# Altium project MLB_REV1.PrjPcb (part 1 of 3)
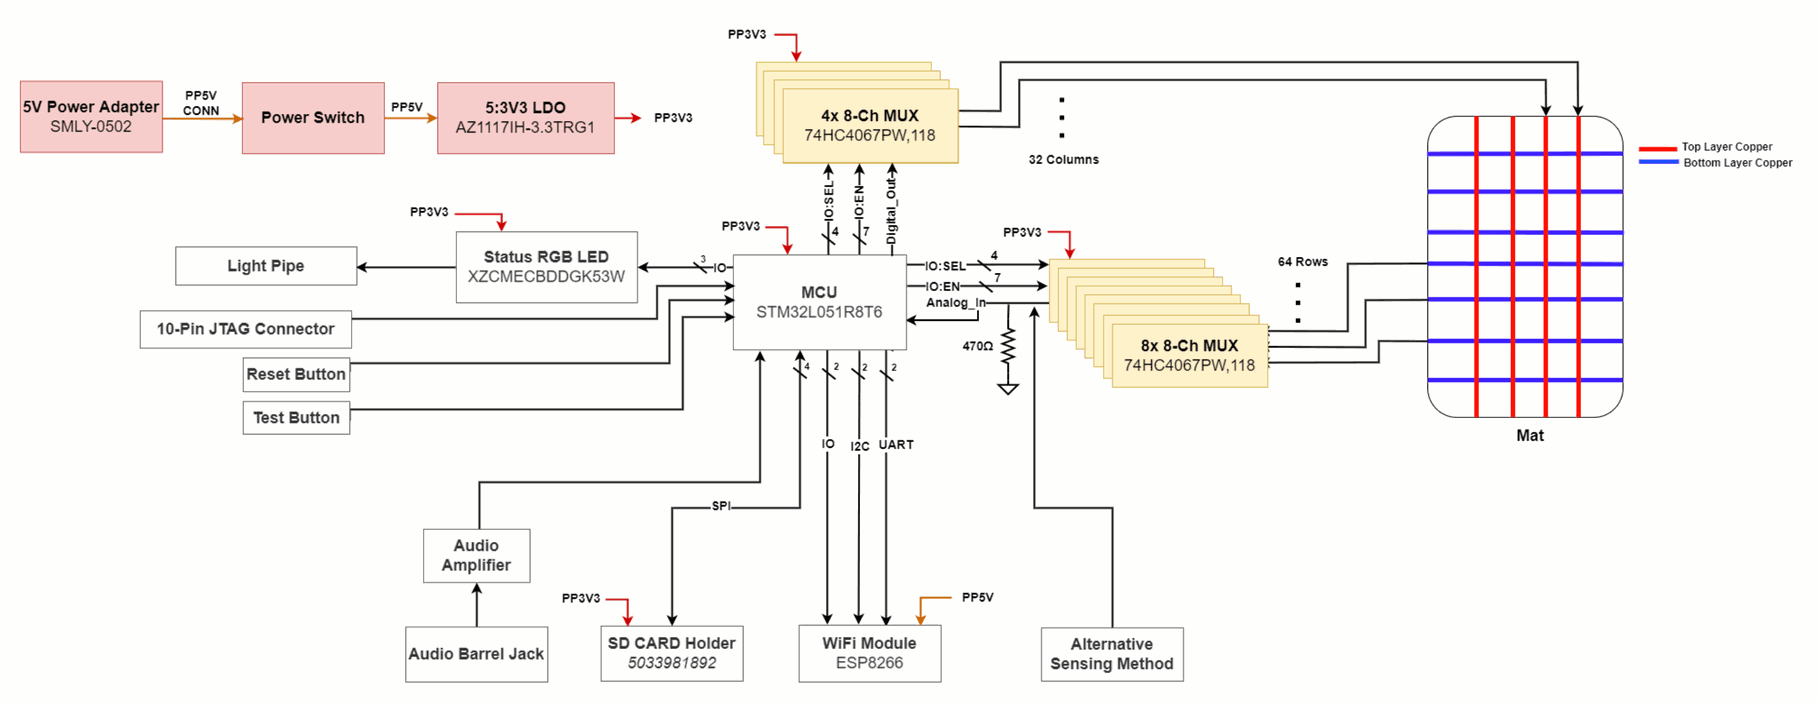
[diagram p0: BLOCK_DIAGRAM.SchDoc]
8 sheets, 307 parts. Net scope: flat (ports and power ports of the same name join across sheets).
Board file: MLB_REV1.PcbDoc
Sheets:
  BLOCK_DIAGRAM.SchDoc
  POWER_MCU.SchDoc
  SD_CARD_WiFi.SchDoc
  POWER_MUXES.SchDoc
  SENSE_MUXES.SchDoc
  VELOSTAT_SENSING.SchDoc
  MAT_CABLING_CONNECTOR.SchDoc
  MICROPHONE.SchDoc

## Sheet BLOCK_DIAGRAM.SchDoc: =DocumentName
size B; SheetNumber: 1; SheetTotal: 8

### Notes on the sheet
- Title
- Size:
- Date:
- B
- Number:
- Time:
- Revision:
- Sheet
- of
- File:

## Sheet POWER_MCU.SchDoc: =DocumentName
size B; SheetNumber: 2; SheetTotal: 8
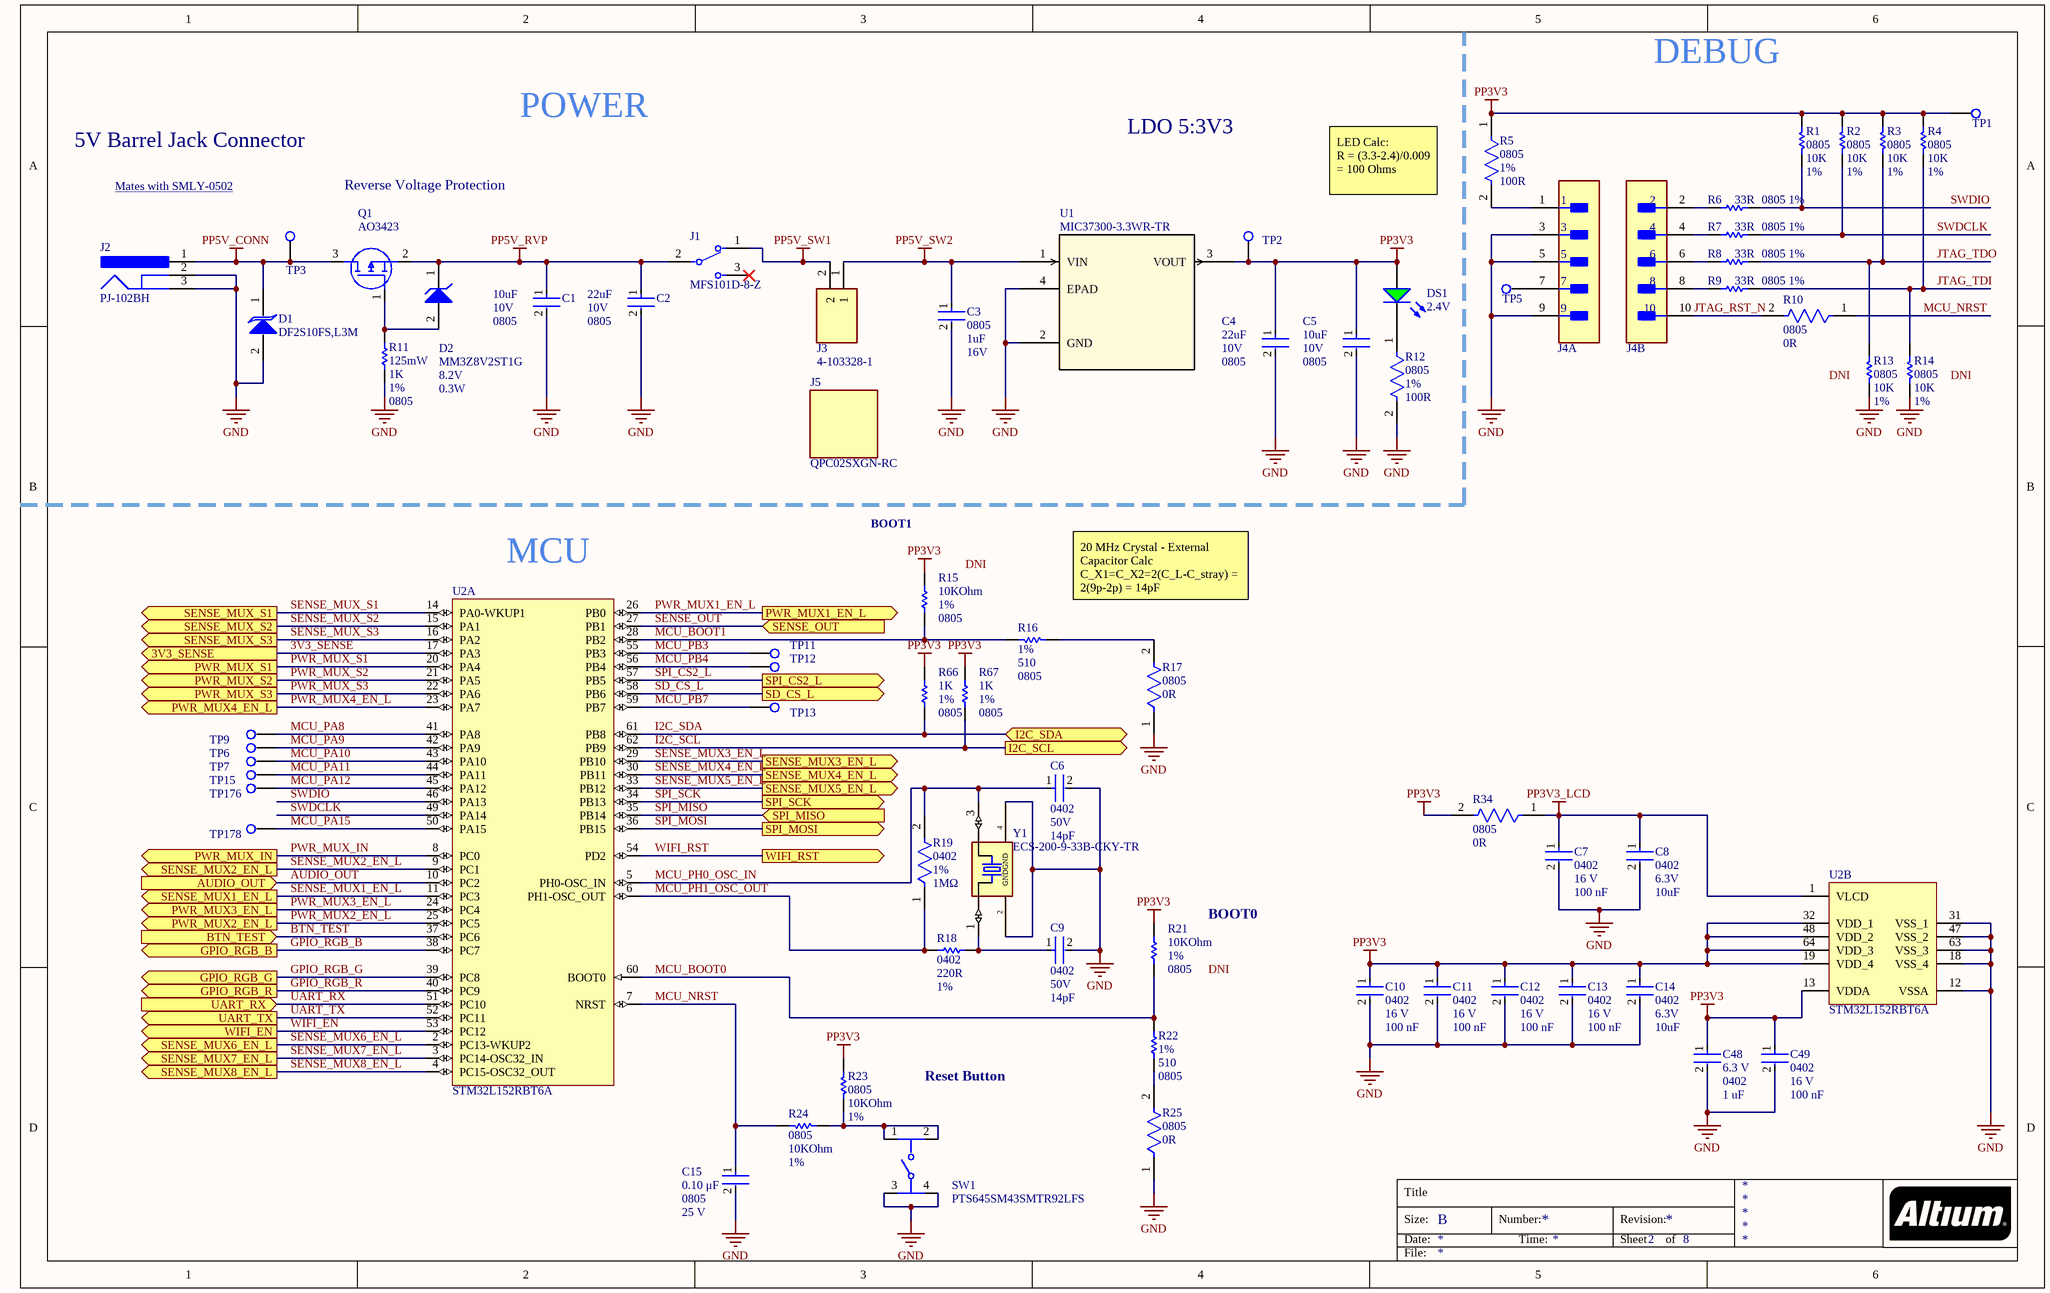
[diagram p1: POWER_MCU.SchDoc]

### Parts
(Parts that share a designator on the sheet are numbered #1, #2 ... from top to bottom, then left to right.)
C1  Case/Package: 0805  Voltage Rating (DC): 10V  Capacitance: 10uF  [FP-GRM21B-0_15-IPC_A]  (hidden comment: GRM21BR71A106KA73K)
C2  Capacitance: 22uF  Voltage Rating: 10V  Case/Package: 0805  [FP-GRM21B-0_15-IPC_A]  (hidden comment: GRM21BR61A226ME51L)
C3  Case/Package: 0805  Capacitance: 1uF  Voltage: 16V  [FP-CL21-IPC_A]  (hidden comment: CL21B105KOFNNNE)
C4  Capacitance: 22uF  Voltage Rating: 10V  Case/Package: 0805  [FP-GRM21B-0_15-IPC_A]  (hidden comment: GRM21BR61A226ME51L)
C5  Case/Package: 0805  Voltage Rating (DC): 10V  Capacitance: 10uF  [FP-GRM21B-0_15-IPC_A]  (hidden comment: GRM21BR71A106KA73K)
C6  Package Reference: 0402  Voltage Rating (DC): 50V  Capacitance: 14pF  [FP-CC0402-IPC_B]  (hidden comment: GJM1555C1H140GB01D)
C7  Package: 0402  Voltage Rating: 16 V  Capacitance: 100 nF  [FP-CC0402-IPC_B]  (hidden comment: CC0402KRX7R7BB104)
C8  Package: 0402  Voltage: 6.3V  Capacitance: 10uF  [FP-CC0402-IPC_B]  (hidden comment: GRM155R60J106ME05D)
C9  Package Reference: 0402  Voltage Rating (DC): 50V  Capacitance: 14pF  [FP-CC0402-IPC_B]  (hidden comment: GJM1555C1H140GB01D)
C10  Package: 0402  Voltage Rating: 16 V  Capacitance: 100 nF  [FP-CC0402-IPC_B]  (hidden comment: CC0402KRX7R7BB104)
C11  Package: 0402  Voltage Rating: 16 V  Capacitance: 100 nF  [FP-CC0402-IPC_B]  (hidden comment: CC0402KRX7R7BB104)
C12  Package: 0402  Voltage Rating: 16 V  Capacitance: 100 nF  [FP-CC0402-IPC_B]  (hidden comment: CC0402KRX7R7BB104)
C13  Package: 0402  Voltage Rating: 16 V  Capacitance: 100 nF  [FP-CC0402-IPC_B]  (hidden comment: CC0402KRX7R7BB104)
C14  Package: 0402  Voltage: 6.3V  Capacitance: 10uF  [FP-CC0402-IPC_B]  (hidden comment: GRM155R60J106ME05D)
C15  Capacitance: 0.10 μF  Package: 0805  Voltage Rating: 25 V  [FP-C0805C-DN-IPC_B]  (hidden comment: C0805C104M3RACTU)
C48#1  Voltage Rating: 6.3 V  Package: 0402  Capacitance: 1 uF  [FP-CC0402-IPC_B]  (hidden comment: CC0402KRX5R5BB105)
C49#1  Package: 0402  Voltage Rating: 16 V  Capacitance: 100 nF  [FP-CC0402-IPC_B]  (hidden comment: CC0402KRX7R7BB104)
D1  DF2S10FS,L3M  [DIOM106X45N]
D2  MM3Z8V2ST1G  Zener Voltage: 8.2V  P Max (W): 0.3W  [ONSC-SOD-323-2-477-02_V]
DS1  Forward Voltage: 2.4V  [DIAL-0805-2_V]  (hidden comment: 598-8170-107F)
J1  MFS101D-8-Z  [CONN03_MFS_11P8X5P8_NDC]
J2  PJ-102BH  [CUI-PJ-102BH_V]
J3  4-103328-1  [TE_4-103328-1]
J4  3220-10-0300-00  [CNC_Tech_0_MFG]  (value not drawn)  (parts A,B of 2)
J5  QPC02SXGN-RC  [FP-QPC02SXGN-RC-MFG]
Q1  AO3423  [SOT95P280X125-3N]
R1  value 10K  PackageReference: 0805  Tolerance: 1%  [RESC2013X60X35NL10T20]  (hidden comment: RC0805FR-0710KL)
R2  value 10K  PackageReference: 0805  Tolerance: 1%  [RESC2013X60X35NL10T20]  (hidden comment: RC0805FR-0710KL)
R3  value 10K  PackageReference: 0805  Tolerance: 1%  [RESC2013X60X35NL10T20]  (hidden comment: RC0805FR-0710KL)
R4  value 10K  PackageReference: 0805  Tolerance: 1%  [RESC2013X60X35NL10T20]  (hidden comment: RC0805FR-0710KL)
R5  Case Code (Imperial): 0805  Tolerance: 1%  Resistance: 100R  [FP-RMCF0805-IPC_A]  (hidden comment: RMCF0805FT100R)
R6  Package Reference: 0805  Tolerance: 1%  Resistance: 33R  [RESC2013X60X35NL10T20]  (hidden comment: RC0805FR-0733RL)
R7  Package Reference: 0805  Tolerance: 1%  Resistance: 33R  [RESC2013X60X35NL10T20]  (hidden comment: RC0805FR-0733RL)
R8  Package Reference: 0805  Tolerance: 1%  Resistance: 33R  [RESC2013X60X35NL10T20]  (hidden comment: RC0805FR-0733RL)
R9  Package Reference: 0805  Tolerance: 1%  Resistance: 33R  [RESC2013X60X35NL10T20]  (hidden comment: RC0805FR-0733RL)
R10  Case/Package: 0805  Resistance: 0R  [FP-RMCF0805-MFG]  (hidden comment: RMCF0805ZT0R00)
R11  Max Power Dissipation: 125mW  Resistance: 1K  Tolerance: 1%  Case Code (Imperial): 0805  [RESC2013X60X35ML10T20]  (hidden comment: RC0805FR-071KL)
R12  Case Code (Imperial): 0805  Tolerance: 1%  Resistance: 100R  [FP-RMCF0805-IPC_A]  (hidden comment: RMCF0805FT100R)
R13  value 10K  PackageReference: 0805  Tolerance: 1%  [RESC2013X60X35NL10T20]  (hidden comment: RC0805FR-0710KL)
R14  value 10K  PackageReference: 0805  Tolerance: 1%  [RESC2013X60X35NL10T20]  (hidden comment: RC0805FR-0710KL)
R15  value 10KOhm  PackageReference: 0805  Tolerance: 1%  [RESC2013X60X35NL10T20]  (hidden comment: RC0805FR-0710KL)
R16  Tolerance: 1%  Resistance: 510  Package Reference: 0805  [RESC2013X70X40NL20T20]  (hidden comment: ERJ-6ENF5100V)
R17  Case/Package: 0805  Resistance: 0R  [FP-RMCF0805-MFG]  (hidden comment: RMCF0805ZT0R00)
R18  Package Reference: 0402  Resistance: 220R  Tolerance: 1%  [FP-CC0402-IPC_B]  (hidden comment: RC0402FR-07220RL)
R19  value 1MΩ  Package Reference: 0402  Tolerance: 1%  [FP-CC0402-IPC_B]  (hidden comment: CRGCQ0402F1M0)
R21  value 10KOhm  PackageReference: 0805  Tolerance: 1%  [RESC2013X60X35NL10T20]  (hidden comment: RC0805FR-0710KL)
R22  Tolerance: 1%  Resistance: 510  Package Reference: 0805  [RESC2013X70X40NL20T20]  (hidden comment: ERJ-6ENF5100V)
R23  value 10KOhm  PackageReference: 0805  Tolerance: 1%  [RESC2013X60X35NL10T20]  (hidden comment: RC0805FR-0710KL)
R24  value 10KOhm  Package Reference: 0805  Tolerance: 1%  [RESC2013X50X30ML20T20]  (hidden comment: CRCW080515K0FKTA)
R25  Case/Package: 0805  Resistance: 0R  [FP-RMCF0805-MFG]  (hidden comment: RMCF0805ZT0R00)
R34#1  Case/Package: 0805  Resistance: 0R  [FP-RMCF0805-MFG]  (hidden comment: RMCF0805ZT0R00)
R66#1  Resistance: 1K  Tolerance: 1%  Case Code (Imperial): 0805  [RESC2013X60X35ML10T20]  (hidden comment: RC0805FR-071KL)
R67#1  Resistance: 1K  Tolerance: 1%  Case Code (Imperial): 0805  [RESC2013X60X35ML10T20]  (hidden comment: RC0805FR-071KL)
SW1  PTS645SM43SMTR92LFS  [FP-PTS645SM43SMTR92LFS-MFG]
TP1  RCU-0C  [TP+195X110]  (value not drawn)
TP2  RCU-0C  [TP+195X110]  (value not drawn)
TP3  RCU-0C  [TP+195X110]  (value not drawn)
TP5  RCU-0C  [TP+195X110]  (value not drawn)
TP6  RCU-0C  [TP+195X110]  (value not drawn)
TP7  RCU-0C  [TP+195X110]  (value not drawn)
TP9  RCU-0C  [TP+195X110]  (value not drawn)
TP11  RCU-0C  [TP+195X110]  (value not drawn)
TP12  RCU-0C  [TP+195X110]  (value not drawn)
TP13  RCU-0C  [TP+195X110]  (value not drawn)
TP15#1  RCU-0C  [TP+195X110]  (value not drawn)
TP176  RCU-0C  [TP+195X110]  (value not drawn)
TP178  RCU-0C  [TP+195X110]  (value not drawn)
U1  MIC37300-3.3WR-TR  [S-PAK-3_R_MCH]
U2  STM32L152RBT6A  [STM-LQFP64_L]  (parts A,B of 2)
Y1  ECS-200-9-33B-CKY-TR  [XTAL_ECS-260-9-33B-CKY-TR]

### Ports
3V3_SENSE (out), AUDIO_OUT (in), BTN_TEST (in), GPIO_RGB_B (out), GPIO_RGB_G (out), GPIO_RGB_R (out), I2C_SCL (out), I2C_SDA (bidir), PWR_MUX1_EN_L (out), PWR_MUX2_EN_L (out), PWR_MUX3_EN_L (out), PWR_MUX4_EN_L (out), PWR_MUX_IN (out), PWR_MUX_S1 (out), PWR_MUX_S2 (out), PWR_MUX_S3 (out), SD_CS_L (out), SENSE_MUX1_EN_L (out), SENSE_MUX2_EN_L (out), SENSE_MUX3_EN_L (out), SENSE_MUX4_EN_L (out), SENSE_MUX5_EN_L (out), SENSE_MUX6_EN_L (out), SENSE_MUX7_EN_L (out), SENSE_MUX8_EN_L (out), SENSE_MUX_S1 (out), SENSE_MUX_S2 (out), SENSE_MUX_S3 (out), SENSE_OUT (in), SPI_CS2_L (out), SPI_MISO (in), SPI_MOSI (out), SPI_SCK (out), UART_RX (in), UART_TX (out), WIFI_EN (out), WIFI_RST (out)

### Nets
GND: C1.2 C2.2 C3.2 C4.2 C5.2 C6.2 C7.2 C8.2 C9.2 C10.2 C11.2 C12.2 C13.2 C14.2 C15.2 C48#1.2 C49#1.2 D1.2(A) J2.2 J2.3 J4.3 J4.5 J4.9 R11.1 R12.2 R13.1 R14.1 R17.1 R25.1 SW1.3 SW1.4 U1.2(GND) U1.4(EPAD) U2.12(VSSA) U2.18(VSS_4) U2.31(VSS_1) U2.47(VSS_2) U2.63(VSS_3) Y1.2(GND) Y1.4(GND)
PP3V3: C4.1 C5.1 C10.1 C11.1 C12.1 C13.1 C14.1 C48#1.1 C49#1.1 DS1.1(A) R1.2 R2.2 R3.2 R4.2 R5.1 R15.2 R21.2 R23.2 R34#1.2 R66#1.1 R67#1.1 TP1.1 TP2.1 U1.3(VOUT) U2.13(VDDA) U2.19(VDD_4) U2.32(VDD_1) U2.48(VDD_2) U2.64(VDD_3)
PP3V3_LCD: C7.1 C8.1 R34#1.1 U2.1(VLCD)
PP5V_CONN: D1.1(K) J2.1 Q1.3(D) TP3.1
PP5V_RVP: C1.1 C2.1 D2.1(K) J1.2 Q1.2(S)
PP5V_SW1: J1.1 J3.2
PP5V_SW2: C3.1 J3.1 U1.1(VIN)
3V3_SENSE: U2.17(PA3) ; port 3V3_SENSE
AUDIO_OUT: U2.10(PC2) ; port AUDIO_OUT
BTN_TEST: U2.37(PC6) ; port BTN_TEST
GPIO_RGB_B: U2.38(PC7) ; port GPIO_RGB_B
GPIO_RGB_G: U2.39(PC8) ; port GPIO_RGB_G
GPIO_RGB_R: U2.40(PC9) ; port GPIO_RGB_R
I2C_SCL: R67#1.2 U2.62(PB9) ; port I2C_SCL
I2C_SDA: R66#1.2 U2.61(PB8) ; port I2C_SDA
JTAG_RST_N: J4.10 R10.2
JTAG_TDI: R4.1 R9.2 R14.2
JTAG_TDO: R3.1 R8.2 R13.2
MCU_BOOT0: R21.1 R22.2 U2.60(BOOT0)
MCU_BOOT1: R15.1 R16.2 U2.28(PB2)
MCU_NRST: C15.1 R10.1 R24.2 U2.7(NRST)
MCU_PA8: TP9.1 U2.41(PA8)
MCU_PA9: TP6.1 U2.42(PA9)
MCU_PA10: TP7.1 U2.43(PA10)
MCU_PA11: TP15#1.1 U2.44(PA11)
MCU_PA12: TP176.1 U2.45(PA12)
MCU_PA15: TP178.1 U2.50(PA15)
MCU_PB3: TP11.1 U2.55(PB3)
MCU_PB4: TP12.1 U2.56(PB4)
MCU_PB7: TP13.1 U2.59(PB7)
MCU_PH0_OSC_IN: C6.1 R19.2 U2.5(PH0-OSC_IN) Y1.3(OUT/IN)
MCU_PH1_OSC_OUT: R18.1 R19.1 U2.6(PH1-OSC_OUT)
PWR_MUX1_EN_L: U2.26(PB0) ; port PWR_MUX1_EN_L
PWR_MUX2_EN_L: U2.25(PC5) ; port PWR_MUX2_EN_L
PWR_MUX3_EN_L: U2.24(PC4) ; port PWR_MUX3_EN_L
PWR_MUX4_EN_L: U2.23(PA7) ; port PWR_MUX4_EN_L
PWR_MUX_IN: U2.8(PC0) ; port PWR_MUX_IN
PWR_MUX_S1: U2.20(PA4) ; port PWR_MUX_S1
PWR_MUX_S2: U2.21(PA5) ; port PWR_MUX_S2
PWR_MUX_S3: U2.22(PA6) ; port PWR_MUX_S3
SD_CS_L: U2.58(PB6) ; port SD_CS_L
SENSE_MUX1_EN_L: U2.11(PC3) ; port SENSE_MUX1_EN_L
SENSE_MUX2_EN_L: U2.9(PC1) ; port SENSE_MUX2_EN_L
SENSE_MUX3_EN_L: U2.29(PB10) ; port SENSE_MUX3_EN_L
SENSE_MUX4_EN_L: U2.30(PB11) ; port SENSE_MUX4_EN_L
SENSE_MUX5_EN_L: U2.33(PB12) ; port SENSE_MUX5_EN_L
SENSE_MUX6_EN_L: U2.2(PC13-WKUP2) ; port SENSE_MUX6_EN_L
SENSE_MUX7_EN_L: U2.3(PC14-OSC32_IN) ; port SENSE_MUX7_EN_L
SENSE_MUX8_EN_L: U2.4(PC15-OSC32_OUT) ; port SENSE_MUX8_EN_L
SENSE_MUX_S1: U2.14(PA0-WKUP1) ; port SENSE_MUX_S1
SENSE_MUX_S2: U2.15(PA1) ; port SENSE_MUX_S2
SENSE_MUX_S3: U2.16(PA2) ; port SENSE_MUX_S3
SENSE_OUT: U2.27(PB1) ; port SENSE_OUT
SPI_CS2_L: U2.57(PB5) ; port SPI_CS2_L
SPI_MISO: U2.35(PB14) ; port SPI_MISO
SPI_MOSI: U2.36(PB15) ; port SPI_MOSI
SPI_SCK: U2.34(PB13) ; port SPI_SCK
SWDCLK: R2.1 R7.2 U2.49(PA14)
SWDIO: R1.1 R6.2 U2.46(PA13)
UART_RX: U2.51(PC10) ; port UART_RX
UART_TX: U2.52(PC11) ; port UART_TX
WIFI_EN: U2.53(PC12) ; port WIFI_EN
WIFI_RST: U2.54(PD2) ; port WIFI_RST
NetC9_1: C9.1 R18.2 Y1.1(IN/OUT)
NetD2_2: D2.2(A) Q1.1(G) R11.2
NetDS1_2: DS1.2(K) R12.1
NetJ4_1: J4.1 R5.2
NetJ4_2: J4.2 R6.1
NetJ4_4: J4.4 R7.1
NetJ4_6: J4.6 R8.1
NetJ4_7: J4.7 TP5.1
NetJ4_8: J4.8 R9.1
NetR16_1: R16.1 R17.2
NetR22_1: R22.1 R25.2
NetR23_1: R23.1 R24.1 SW1.1 SW1.2

Not connected (* = marked no-connect by the designer): J1 3*

### Notes on the sheet
- DEBUG
- 5V Barrel Jack Connector
- POWER
- LDO 5:3V3
- Mates with SMLY-0502 <https://www.amazon.ca/100-240V-5-52-5mm-Transformer-Electronic-Equipment/dp/B086JRWFD9/ref=sr_1_5?keywords=5v%2Bdc%2Bpower%2Bsupply&qid=1638245414&refinements=p_85%3A5690392011&rnid=5690384011&rps=1&sr=8-5&th=1>
- Reverse Voltage Protection
- LED Calc:
  R = (3.3-2.4)/0.009 = 100 Ohms
- (near R13) DNI
- (near R14) DNI
- (near U2) MCU
- BOOT1
- (near R15) DNI
- 20 MHz Crystal - External Capacitor Calc
  C_X1=C_X2=2(C_L-C_stray) = 2(9p-2p) = 14pF
- BOOT0
- DNI
- Reset Button
- Title
- Size:
- Date:
- B
- Number:
- Time:
- Revision:
- Sheet
- of
- File:

### Library data of the parts
C1 C5 = CMP-06035-038134-1: Chip Multilayer Ceramic Capacitors for General Purpose, 0805, 10uF, X7R, 15%, 10%, 10V; Manufacturer: Murata Electronics; Dielectric: X7R; Thickness: 1.25mm; Tolerance: 10%; Length: 2mm; Width: 1.25mm; Manufacturer Part Number: GRM21BR71A106KA73K; Supplier Part Number: 490-14381-1-ND; Supplier: Digi-Key
C2 C4 = CMP-2000-06340-2: Chip Multilayer Ceramic Capacitors for General Purpose, 0805, 22uF, X5R, 15%, 20%, 10V; Manufacturer: Murata Electronics; Thickness: 0.055inch; Length: 2mm; Tolerance: 20%; Max Operating Temperature: 85°C; REACH SVHC: No SVHC; Radiation Hardening: No; Weight: 0.000335oz; Case Code (Metric): 2012; Case Code (Imperial): 0805; Height: 1.25mm; Min Operating Temperature: -55°C; Voltage Rating (DC): 10V; Lead Free: Lead Free; Package Quantity: 3000; Dielectric: X5R; Mount: Surface Mount; Termination: SMD/SMT; Width: 0.049inch; Depth: 1.25mm; Packaging: Tape and Reel; Manufacturer Part Number: GRM21BR61A226ME51L; Supplier Part Number: 490-10511-1-ND; Supplier: Digi-Key
C3 = CMP-13271-003098-1: CL21 Series 0805 1uF 16V ±10% Tolerance X7R Multilayer Ceramic Chip Capacitor; Manufacturer: Samsung Electro-Mechanics; Width: 0.049inch; Thickness: 0.053inch; Voltage Rating: 16V; Max Operating Temperature: 125°C; Case Code (Imperial): 0805; Height: 1.25mm; Length: 2mm; Lead Free: Lead Free; Mount: Surface Mount; Tolerance: 10%; Voltage Rating (DC): 16V; Min Operating Temperature: -55°C; Contact Plating: Tin; Depth: 1.25mm; Packaging: Tape and Reel; Package Quantity: 1; Dielectric: X7R; Radiation Hardening: No; Case Code (Metric): 2012; Manufacturer Part Number: CL21B105KOFNNNE; Supplier: Digi-Key; Supplier Part Number: 1276-1026-1-ND
C6 C9 = CMP-06035-028518-1: Multi-Layer Ceramic Capacitor 14pF C0G  ±2% 0402 Paper T/R; Manufacturer: Murata Electronics; Tolerance: 2%; Length: 1mm; Dielectric: C0G; Thickness: 500um; Width: 500um; Manufacturer Part Number: GJM1555C1H140GB01D; Supplier: Digi-Key; Supplier Part Number: 490-14443-1-ND
C7 C10-C13 C49#1 = CMP-03422-000048-1: CAP CER 0.1UF 16V X7R 0402; Manufacturer: YAGEO; Material: Ceramic; Automotive Grade: NA; Temperature Coefficient: 30ppm/°C; Tolerance: 0.1; Value: 100 nF; Device Class L1: Passive Components; Temperature Range Low: -55°C; Device Class L3: Ceramic Capacitors; Temperature Characteristic: X7R; Ipc Land Pattern Name: CAPC10050X50; Temperature Range High: +125°C; Temperature: -55°C to +125°C; RoHS: TRUE; Automotive: No; Height: 0.55mm; Device Class L2: Capacitors; Digikey Description: CAP CER 0.1UF 16V X7R 0402; Footprint Url: http://www.yageo.com/exep/pages/download/literatures/UPY-C_GEN_24.pdf; ComponentLink2Description: Datasheet; Category: Cap; Lead Free: Yes; Octopart: https://octopart.com/cc0402krx7r7bb104-yageo-42244624; ComponentLink2URL: http://www.yageo.com/documents/recent/UPY-GP_NP0_16V-to-50V_16.pdf; Manufacturer Part Number: CC0402KRX7R7BB104; Mouser Description: 0402 0.1 uF 16 V ±10 % Tolerance X7R SMT Multilayer Ceramic Capacitor; Supplier: Digi-Key; Supplier Part Number: 311-1338-1-ND
C8 C14 = CMP-06035-044652-1: Chip Multilayer Ceramic Capacitors for General Purpose, 0402, 10uF, X5R, 15%, 20%, 6.3V; Manufacturer: Murata Electronics; Manufacturer Part Number: GRM155R60J106ME05D; Supplier: Digi-Key; Supplier Part Number: 490-GRM155R60J106ME05DCT-ND
C15 = CMP-2007-00282-2: CAP CER 0.1UF 25V 20% X7R 0805; Manufacturer: KEMET; Temperature Coefficient: 30ppm/°C; Material: Ceramic; Tolerance: 0.2; Value: 0.10 μF; Digikey Description: CAP CER 0.1UF 25V 20% X7R 0805; Device Class L2: Capacitors; Temperature: -55°C to +125°C; Device Class L1: Passive Components; ComponentLink2Description: Datasheet; Mouser Description: Multilayer Ceramic Capacitors MLCC - SMD/SMT 25volts 0.1uF X7R 20%; Temperature Range High: +125°C; Device Class L3: Ceramic Capacitors; Automotive: No; Temperature Range Low: -55°C; RoHS: TRUE; Category: Cap; Lead Free: Yes; Ipc Land Pattern Name: CAPC200125X78; Height: 0.88mm; Temperature Characteristic: X7R; Octopart: https://octopart.com/c0805c104m3ractu-kemet-9138612; ComponentLink2URL: https://content.kemet.com/datasheets/KEM_C1003_C0G_SMD.pdf; Manufacturer Part Number: C0805C104M3RACTU; Supplier: Digi-Key; Supplier Part Number: 399-C0805C104M3RAC7800CT-ND
C48#1 = CMP-2100-03591-2: CAP CER 1UF 6.3V X5R 0402; Manufacturer: YAGEO; Automotive Grade: NA; Material: Ceramic; Tolerance: 0.1; Temperature Coefficient: 30ppm/°C; Temperature Range Low: -55°C; Digikey Description: CAP CER 1UF 6.3V X5R 0402; Height: 0.55mm; Automotive: No; ComponentLink2URL: http://www.yageo.com/documents/recent/UPY-GP_NP0_16V-to-50V_16.pdf; Device Class L2: Capacitors; RoHS: TRUE; Temperature Range High: +125°C; Device Class L3: Ceramic Capacitors; Device Class L1: Passive Components; Temperature Characteristic: X5R; Octopart: https://octopart.com/cc0402krx5r5bb105-yageo-42244618; ComponentLink2Description: Datasheet; Temperature: -55°C to +125°C; Manufacturer Part Number: CC0402KRX5R5BB105; Mouser Description: Multilayer Ceramic Capacitors MLCC - SMD/SMT 1uF 6.3V X5R 10%; Category: Cap; Footprint Url: http://www.yageo.com/exep/pages/download/literatures/UPY-C_GEN_24.pdf; Lead Free: Yes; Ipc Land Pattern Name: CAPC10050X50; Value: 1 uF; Supplier: Digi-Key; Supplier Part Number: 311-1438-1-ND
D1 = DF2S10FS,L3M: TVS DIODE 8VWM FSC; Manufacturer_Name: Toshiba; Manufacturer: Toshiba Semiconductor and Storage; Datasheet Link: https://componentsearchengine.com/Datasheets/1/DF2S10FS,L3M.pdf; Height: 0.45mm; Manufacturer_Part_Number: DF2S10FS,L3M; Mouser Part Number: 757-DF2S10FSL3M; Mouser Price/Stock: https://www.mouser.co.uk/ProductDetail/Toshiba/DF2S10FSL3M?qs=lhkzy8lC%252BSsM5fAm2E7mCQ%3D%3D; Arrow Part Number: DF2S10FS,L3M; Arrow Price/Stock: https://www.arrow.com/en/products/df2s10fsl3m/toshiba?region=nac; Manufacturer Part Number: DF2S10FS,L3M; Supplier: Digi-Key; Supplier Part Number: DF2S10FSL3MCT-ND
D2 = MM3Z8V2ST1G: Zener Voltage Regulator, 300 mW, Tight Tolerance Portfolio, 2-Pin SOD-323, Pb-Free, Tape and Reel; Manufacturer: On Semiconductor; PackageVersion: Rev. H, 03/2007; RoHS: Pb-Free; Mounting Technology: Surface Mount; Manufacturer Part Number: MM3Z8V2ST1G; PackageDescription: 2-Pin SOD, Body 1.7 x 1.25 mm; ComponentLink2Description: Datasheet; ComponentLink3Description: Package Specification; PackageReference: SOD-323-2-477-02; ComponentLink1Description: Manufacturer URL; ComponentLink3URL: http://www.onsemi.com/pub_link/Collateral/477-02.PDF.1; ComponentLink1URL: http://www.onsemi.com/; DatasheetVersion: Rev. 21; Packing: Tape and Reel; ComponentLink2URL: http://www.onsemi.cn/pub_link/Collateral/MM3Z2V4ST1-D.PDF; Supplier: Digi-Key; Supplier Part Number: MM3Z8V2ST1GOSCT-ND
DS1 = CMP-2000-05655-1: Single Color, 2 V, -30 to 85 degC, 2-Pin SMD (0805), RoHS, Tape and Reel; Manufacturer: Dialight; Manufacturer Part Number: 5988170107F; Main Category: ChipLED; Shape Type: Rectangular; Forward Current: 25mA; Product Length (mm): 2mm; Emitting Color: YellowGreen; Test Current (It): 20mA; Number of  Elements: 1; Luminous Intensity: 20mcd; DELETED: Compliant; Reverse Voltage: 5V; Chip Material: GaP; High Brightness: No; Viewing Angle: 140deg; Dominant Wave Length: 570nm; Type: Uni-Color; Product Depth (mm): 1.25mm; Power Dissipation: 60W; Product Height (mm): 0.7mm; Lens Dimensions: 1.4x1.25x0.4mm; Pin Count: 2; Datasheet URL: https://datasheet.ciiva.com/22748/1484480-22748121.pdf; Operating Temperature Classification: Commercial; Package Reference: 0805; Operating Temp Range: -30Cto85C; Mounting: SurfaceMount; Mounting Technology: SurfaceMount; Manufacturer URL: http://www.dialight.com/; Package Description: 2-Pin Surface Mount Device, Body 2 x 1.25 mm; Lum Intensity: 20mcd; Datasheet Version: 10/2008; Rad Hardened: No; Packaging: TapeandReel; Package Type: SMD; Supplier: Digi-Key; Supplier Part Number: 350-2044-1-ND
J1 = MFS101D-8-Z: No Description Available; Manufacturer: Nidec Copal Electronics; Copyright: Copyright (C) 2022 Ultra Librarian. All rights reserved.; RefDes: RefDes; Type: DEV; Supplier: Digi-Key; Supplier Part Number: 563-1556-ND; Manufacturer Part Number: MFS101D-8-Z
J2 = PJ-102BH: Through Hole Right Angle DC Power Jack, 5 A, 2.5 mm Center Pin, 3 Position, -25 to 85 degC, RoHS, Bulk; Manufacturer: CUI Devices; Outside Contact Diameter: 6.5mm; Current Rating: 5A; Brand: CUI; Insulation Resistance: 100MOhms; Inside Contact Diameter: 2.5mm; Voltage Rating: 24V; Operating Temperature Range: -25Cto+85C; Mounting Angle: Right; Mounting Technology: ThroughHole; Product Category: DCPowerConnectors; Datasheet Version: Rev. 1.02, 05/2016; Connector Type: DCPowerJack; Contact Material: Copper; Housing Material: PolybutyleneTerephthalate(PBT); Mounting Style: ThroughHole; Product: Jacks; Package Reference: PJ-102BH; Manufacturer URL: http://www.cui.com/; RoHS: True; Contact Gender: Male; Contact Plating: Nickel; Flammability Rating: UL94V-0; Factory Pack Quantity: 280; Datasheet URL: http://www.cui.com/product/resource/pj-102bh.pdf; Package Description: 3-Pin Through Hole Device, Body 14.4 x 9 mm, Height 11 mm; Termination Style: ThroughHole; Supplier Part Number: CP-102BH-ND; Manufacturer Part Number: PJ-102BH; Supplier: Digi-Key
J3 = 4-103328-1: Connector Header Through Hole 2 position; Manufacturer: TE Connectivity AMP Connectors; MF: TE Connectivity; SnapEDA_Link: https://www.snapeda.com/parts/4-103328-1/TE%20Connectivity%20AMP%20Connectors/view-part/2384420/?ref=snap; MP: 4-103328-1; TE_purchase_URL: https://www.te.com/usa-en/product-4-103328-1.html?te_bu=Cor&te_type=disp&te_campaign=seda_glo_cor-seda-global-disp-prtnr-fy19-seda-model-bom-cta_sma-317_1&elqCampaignId=32493; Availability: Unavailable; Value: *; EU_RoHS_Compliance: Compliant; Price: None; Package: None; Supplier: Digi-Key; Supplier Part Number: A121364-ND; Manufacturer Part Number: 4-103328-1
J4 = 3220-10-0300-00: CONN HEADER SMD 10POS 1.27MM; Manufacturer: CNC Tech; Manufacturer Part Number: 3220-10-0300-00; Supplier: Digi-Key; Supplier Part Number: 1175-1629-ND
J5 = CMP-25666-000001-1: CONN JUMPER SHORTING .100" GOLD; Manufacturer: Sullins; Conn Orientation: Straight; Pitch: 2.54mm; Current Rating: 3A; Number Of Contacts: 2; Category: Conn; Temperature Range Low: -40°C; Temperature Range High: +85°C; Device Class L1: Connectors; Lead Free: Yes; Manufacturer Part Number: QPC02SXGN-RC; Automotive: No; Height: 6.17mm; ComponentLink2URL: https://s3.amazonaws.com/catalogspreads-pdf/PAGE128-129%20.100%20JUMPER.pdf; Device Class L2: unset; Footprint Url: https://drawings-pdf.s3.amazonaws.com/11510.pdf; Device Class L3: unset; Temperature: -40°C to +85°C; RoHS: TRUE; Digikey Description: CONN JUMPER SHORTING .100" GOLD; Octopart: https://octopart.com/qpc02sxgn-rc-sullins-19878795; Package: 0; ComponentLink2Description: Datasheet; Contact Material: Gold; Supplier: Digi-Key; Supplier Part Number: S9337-ND
Q1 = AO3423: MOSFET (P-Channel); Manufacturer: Alpha & Omega Semiconductors; Datasheet Link: http://www.aosmd.com/pdfs/datasheet/AO3423.pdf; Height: 1.25mm; Manufacturer Part Number: AO3423; Supplier Part Number: 785-1016-1-ND; Supplier: Digi-Key; Arrow Part Number: AO3423; Arrow Price/Stock: https://www.arrow.com/en/products/ao3423/alpha-and-omega-semiconductor?region=nac
R1-R4 R13-R15 R21 R23 = CMP-1659-00013-4: Chip Resistor, 10 KOhm, +/- 1%, 0.125 W, -55 to 155 degC, 0805 (2012 Metric), RoHS, Tape and Reel; Manufacturer: Yageo; Voltage Rating: 150 V; Mount: Surface Mount; ComponentLink1Description: Manufacturer URL; ComponentLink2URL: http://www.yageo.com/documents/recent/PYu-RC_Group_51_RoHS_L_04.pdf; Pins: 2; Length: 2 mm; Min Operating Temperature: -55 degC; Height: 0.5 mm; Mounting Technology: Surface Mount; RoHSCompliant: true; REACH SVHC: No SVHC; ComponentLink1URL: http://www.yageo.com/; Max Operating Temperature: 155 degC; DatasheetVersion: Rev. 4, 02/2016; Package Quantity: 5000; Packaging: Tape and Reel; ComponentLink2Description: Datasheet; PackageDescription: 2-Pin Surface Mounted Device, Body 2 x 1.25 mm; Manufacturer Part Number: RC0805FR-0710KL; Supplier: Digi-Key; Supplier Part Number: RC0805FR-0710KL
R5 R12 = CMP-26527-001731-1: 100Ω ±1% 0.125W 0805 Thick Film Chip Resistor AEC-Q200 compliant; Manufacturer: Stackpole Electronics Inc; Power Rating: 250mW; Temperature Coefficient: 100ppm/°C; Max Power Dissipation: 125mW; Radiation Hardening: No; RoHS Compliant: Yes; Depth: 1.25mm; Length: 2mm; Min Operating Temperature: -55°C; Series: RMCF; Packaging: Tape and Reel; Features: Automotive AEC-Q200; Height: 0.026inch; Size Code: 0805; Number of Terminations: 2; Max Operating Temperature: 155°C; Case/Package: 0805; Width: 0.049inch; Contact Plating: Tin; Resistor Type: Thick Film; Construction: Rectangular; Lead Free: Lead Free; Military Standard: Not; Case Code (Metric): 2012; Mount: Surface Mount; Manufacturer Part Number: RMCF0805FT100R; Supplier: Digi-Key; Supplier Part Number: RMCF0805FT100RCT-ND
R6-R9 = CMP-1659-00015-4: Chip Resistor, 33 Ohm, +/- 1%, 0.125 W, -55 to 155 degC, 0805 (2012 Metric), RoHS, Tape and Reel; Manufacturer: Yageo; Voltage Rating: 150 V; Max Operating Temperature: 155 degC; DatasheetVersion: Rev. 4, 02/2016; RoHSCompliant: true; ComponentLink2Description: Datasheet; PackageDescription: 2-Pin Surface Mounted Device, Body 2 x 1.25 mm; Package Quantity: 5000; Packaging: Tape and Reel; Min Operating Temperature: -55 degC; Mount: Surface Mount; REACH SVHC: No SVHC; ComponentLink1Description: Manufacturer URL; ComponentLink1URL: http://www.yageo.com/; Pins: 2; Mounting Technology: Surface Mount; Height: 0.5 mm; ComponentLink2URL: http://www.yageo.com/documents/recent/PYu-RC_Group_51_RoHS_L_04.pdf; PackageReference: 0805; Length: 2 mm; Manufacturer Part Number: RC0805FR-0733RL; Supplier: Digi-Key; Supplier Part Number: 311-33.0CRCT-ND
R10 R17 R25 R34#1 = CMP-26527-000017-1: RES 0 OHM JUMPER 1/8W 0805; Manufacturer: Stackpole Electronics Inc; Power Rating: 125mW; Depth: 1.25mm; Length: 2mm; Military Standard: Not; Width: 0.049inch; Case Code (Imperial): 0805; Number of Terminations: 2; Mount: Surface Mount; Contact Plating: Tin; Height: 0.026inch; Min Operating Temperature: -55°C; Composition: Thick Film; Max Operating Temperature: 155°C; Packaging: Tape and Reel; Features: Automotive AEC-Q200; Max Power Dissipation: 125mW; Radiation Hardening: No; Lead Free: Lead Free; Case Code (Metric): 2012; Supplier: Digi-Key; Supplier Part Number: RMCF0805ZT0R00CT-ND; Manufacturer Part Number: RMCF0805ZT0R00
R11 = CMP-2100-03671-1: Chip Resistor, 1 KOhm, +/- 1%, 125 mW, -55 to 155 degC, 0805 (2012 Metric), RoHS, Tape and Reel; Manufacturer: Yageo; Temperature Coefficient: 100ppm/degreesC; Voltage Rating (DC): 150V; Number of Pins: 2; Number of Terminations: 2; Datasheet URL: http://www.yageo.com/NewPortal/yageodocoutput?fileName=/pdf/R-Chip/PYu-RC_Group_51_RoHS_L_5.pdf; Length: 0.079inch; Package Description: 2-Pin Surface Mounted Device, Body 2 x 1.25 mm; Depth: 1.25mm; Height: 0.024inch; Military Standard: Not; Case/Package: 0805; Package Reference: 0805; RoHSCompliant: true; Lead Free: LeadFree; Packaging: TapeandReel; Package Quantity: 1; Datasheet Version: Rev. 5, 10/2016; Min Operating Temperature: -55degC; Voltage Rating: 150V; Composition: ThickFilm; Power Rating: 125mW; Width: 0.049inch; Case Code (Metric): 2012; Manufacturer URL: http://www.yageo.com/; Max Operating Temperature: 155degC; REACH SVHC: Unknown; Termination: SMD/SMT; Manufacturer Part Number: RC0805FR-071KL; Supplier: Digi-Key; Supplier Part Number: 311-1.00KCRCT-ND
R16 R22 = CMP-2001-00216-1_1: Manufacturer: Panasonic; Manufacturer Part Number: ERJ-6ENF5100V; Supplier: Digi-Key; Supplier Part Number: P510CCT-ND
R18 = CMP-2002-07511-1: Manufacturer: YAGEO; Manufacturer Part Number: RC0402FR-07220RL; Supplier: Digi-Key; Supplier Part Number: 311-220LRCT-ND
R19 = CMP-03211-005885-1: Res Thick Film 0402 1M Ohm 1% 0.063W(1/16W) ±100ppm/C Pad SMD Automotive T/R; Manufacturer: TE Connectivity Passive Product; Voltage Rating: 50V; Temperature Coefficient: ±100ppm/°C; Power Rating: 0.0625W; Series: CRGCQ; Digikey Description: Res Thick Film 0402 1M Ohm 1% 0.063W(1/16W) ±100ppm/C Pad SMD Automotive T/R; Automotive: Yes; ComponentLink2URL: https://www.te.com/commerce/DocumentDelivery/DDEController?Action=showdoc&DocId=Data+Sheet%7F1773204-3%7F1%7Fpdf%7FEnglish%7FENG_DS_1773204-3_1.pdf%7F4-2176347-1378; Ipc Land Pattern Name: RESC10050X35; Manufacturer Part Number: CRGCQ0402F1M0; Category: Res; ComponentLink2Description: Datasheet; Temperature Range High: +155°C; Temperature Range Low: -55°C; Device Class L3: Chip SMD Resistors; RoHS: TRUE; Lead Free: Yes; Octopart: https://octopart.com/crgcq0402f1m0-te+connectivity-91017950; Ambient Temperature Range High: +70°C; Package: CRGCQ0402; Mouser Description: Res Thick Film 0402 1M Ohm 1% 0.063W(1/16W) ±100ppm/C Pad SMD Automotive T/R; Device Class L1: Passive Components; Resistance: 1MΩ; Temperature: -55°C to +155°C; Composition: Thick Film; Device Class L2: Resistors; Height: 0.4mm; Supplier: Digi-Key; Supplier Part Number: A129663CT-ND
R24 = CMP-2001-04968-1: Manufacturer: Vishay Dale; Manufacturer Part Number: CRCW080515K0FKTA; Supplier: Digi-Key; Supplier Part Number: 541-3019-1-ND
R66#1 R67#1 = CMP-2100-03671-1: Chip Resistor, 1 KOhm, +/- 1%, 125 mW, -55 to 155 degC, 0805 (2012 Metric), RoHS, Tape and Reel; Manufacturer: Yageo; Temperature Coefficient: 100ppm/degreesC; Voltage Rating (DC): 150V; Max Power Dissipation: 125mW; Number of Pins: 2; Number of Terminations: 2; Datasheet URL: http://www.yageo.com/NewPortal/yageodocoutput?fileName=/pdf/R-Chip/PYu-RC_Group_51_RoHS_L_5.pdf; Length: 0.079inch; Package Description: 2-Pin Surface Mounted Device, Body 2 x 1.25 mm; Depth: 1.25mm; Height: 0.024inch; Military Standard: Not; Case/Package: 0805; Package Reference: 0805; RoHSCompliant: true; Lead Free: LeadFree; Packaging: TapeandReel; Package Quantity: 1; Datasheet Version: Rev. 5, 10/2016; Min Operating Temperature: -55degC; Voltage Rating: 150V; Composition: ThickFilm; Power Rating: 125mW; Width: 0.049inch; Case Code (Metric): 2012; Manufacturer URL: http://www.yageo.com/; Max Operating Temperature: 155degC; REACH SVHC: Unknown; Termination: SMD/SMT; Manufacturer Part Number: RC0805FR-071KL; Supplier: Digi-Key; Supplier Part Number: 311-1.00KCRCT-ND
SW1 = PTS645SM43SMTR92_LFS: SWITCH TACTILE SPST-NO 0.05A 12V; Manufacturer: C&K; Contact Resistance: 100mR; Throw Configuration: SPST; Illumination Type: Non-Illuminated; Mechanical Life: 100000Cycles; Current Rating: 50mA; Switch Function: Off-Mom; Actuator Length: 0.85mm; Actuator Material: Nylon; Actuator Type: Standard; Operating Force: 160gf; Min Operating Temperature: -20°C; REACH SVHC: No SVHC; Termination: Gull Wing; Case/Package: SMD/SMT; Packaging: Tape and Reel; Mount: Surface Mount; Voltage Rating (DC): 12V; Orientation: Straight; Lead Free: Lead Free; Contact Material: Silver; Color: Black; Max Current Rating: 50mA; Contact Plating: Silver; Depth: 9mm; Package Quantity: 1; Max Voltage Rating (DC): 12V; Length: 6mm; Max Operating Temperature: 60°C; Manufacturer Part Number: PTS645SM43SMTR92 LFS; Supplier: Digi-Key; Supplier Part Number: CKN9112CT-ND
TP1-TP3 TP5-TP7 TP9 TP11-TP13 TP15#1 TP176 TP178 = RCU-0C: Natural PC Test Point , Plating Surface Mount Mounting Type; Manufacturer: TE Connectivity AMP Connectors; Value: *; Package: SON-6 TE Connectivity AMP Connectors; Purchase-URL: https://pricing.snapeda.com/search/part/RCU-0C/?ref=eda; Supplier Part Number: A106145CT-ND; Check_prices: https://www.snapeda.com/parts/RCU-0C/TE%20Connectivity/view-part/4791537/?ref=eda; Manufacturer Part Number: RCU-0C; SnapEDA_Link: https://www.snapeda.com/parts/RCU-0C/TE%20Connectivity/view-part/4791537/?ref=snap; Supplier: Digi-Key
U1 = MIC37300-3.3WR-TR: IC REG LINEAR 3.3V 3A SPAK-3; Manufacturer: Microchip Technology; Copyright: Copyright (C) 2022 Ultra Librarian. All rights reserved.; RefDes: RefDes; Type: DEV; Manufacturer Part Number: MIC37300-3.3WR-TR; Supplier: Digi-Key; Supplier Part Number: MIC37300-3.3WR-CT-ND
U2 = CMP-0236-00055-2: ARM Cortex-M3 32-bit MCU, 128 KB Flash, 16 KB Internal RAM, 51 I/Os, 64-pin LQFP, -40 to 85 degC, Tray; Manufacturer: STMicroelectronics; D/A Converter: 2x12-bit (2 Channel); Internal RAM Size (kB): 16; Data E2PROM nom (B): 4096; FLASH Size (Prog) (kB): 128; Supply Voltage(Vcc) min (V): 1.65; I/Os (High Current): 51; Operating Frequency(F) (Processor speed) (MHz): 32; Packing: Tray; ComponentLink1Description: Manufacturer URL; PackageVersion: Rev. 4, 06/2013; DatasheetVersion: Rev. 8; PackageDescription: 64-Pin Low Profile Quad Flat Package, 10 x 10 mm Body, 0.5 mm Pitch; ComponentLink3URL: http://www.st.com/st-web-ui/static/active/en/resource/technical/document/datasheet/DM00037051.pdf; Mounting Technology: Surface Mount; PackageReference: LQFP64; ComponentLink1URL: http://www.st.com/web/en/home.html; ComponentLink2Description: Datasheet; ComponentLink3Description: Package Specification; Core: ARM Cortex-M3; PartNumber: STM32L152RBT6A; ComponentLink2URL: http://www.st.com/st-web-ui/static/active/en/resource/technical/document/datasheet/CD00277537.pdf; Manufacturer Part Number: STM32L152RBT6A; Supplier: Mouser; Supplier Part Number: 511-STM32L152RBT6A
Y1 = ECS-200-9-33B-CKY-TR: Crystal 20MHz Â±10ppm (Tol) Â±10ppm (Stability) 9pF FUND 40Ohm 4-Pin Mini-CSMD T/R; MF: ECS Inc.; Availability: Good; Package: None; Value: *; Price: None; SnapEDA_Link: https://www.snapeda.com/parts/ECS-260-9-33B-CKY-TR/ECS%20Inc./view-part/5048361/?ref=snap; Check_prices: https://www.snapeda.com/parts/ECS-260-9-33B-CKY-TR/ECS%20Inc./view-part/5048361/?ref=eda; Purchase-URL: https://pricing.snapeda.com/search/part/ECS-260-9-33B-CKY-TR/?ref=eda; Manufacturer: ECS Inc.; Manufacturer Part Number: ECS-200-9-33B-CKY-TR; Supplier: Digi-Key; Supplier Part Number: XC2464CT-ND